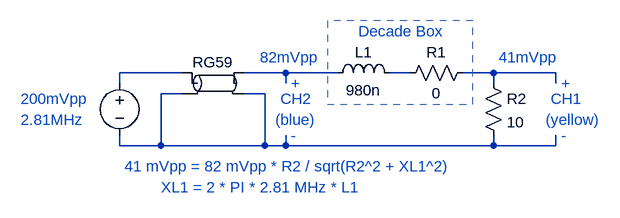
[diagram p0: schematic decade_box_inductance_test.asc]
decade_box_inductance_test.asc, the LTspice schematic file:
Version 4
SHEET 1 932 680
WIRE 272 32 176 32
WIRE 432 32 368 32
WIRE 512 32 432 32
WIRE 624 32 592 32
WIRE 752 32 704 32
WIRE 848 32 752 32
WIRE 176 48 176 32
WIRE 432 48 432 32
WIRE 752 48 752 32
WIRE 848 48 848 32
WIRE 272 64 240 64
WIRE 400 64 368 64
WIRE 176 144 176 128
WIRE 240 144 240 64
WIRE 240 144 176 144
WIRE 400 144 400 64
WIRE 400 144 240 144
WIRE 432 144 432 128
WIRE 432 144 400 144
WIRE 752 144 752 128
WIRE 752 144 432 144
WIRE 848 144 848 128
WIRE 848 144 752 144
SYMBOL voltage 176 32 R0
WINDOW 0 24 16 Invisible 2
SYMATTR InstName V1
SYMATTR Value ""
SYMBOL tline 320 48 R0
SYMATTR InstName RG59
SYMATTR Value ""
SYMBOL ind 496 48 R270
WINDOW 0 32 56 VTop 2
WINDOW 3 5 56 VBottom 2
SYMATTR InstName L1
SYMATTR Value 980n
SYMBOL res 720 16 R90
WINDOW 0 0 56 VBottom 2
WINDOW 3 32 56 VTop 2
SYMATTR InstName R1
SYMATTR Value 0
SYMBOL res 736 32 R0
SYMATTR InstName R2
SYMATTR Value 10
TEXT 24 72 Left 2 ;200mVpp
TEXT 24 104 Left 2 ;2.81MHz
TEXT 440 48 Left 2 ;+
TEXT 440 128 Left 2 ;-
TEXT 424 72 Left 2 ;CH2
TEXT 416 104 Left 2 ;(blue)
TEXT 544 -32 Left 2 ;Decade Box
TEXT 856 48 Left 2 ;+
TEXT 856 128 Left 2 ;-
TEXT 840 72 Left 2 ;CH1
TEXT 832 104 Left 2 ;(yellow)
TEXT 392 8 Left 2 ;82mVpp
TEXT 760 8 Left 2 ;41mVpp
TEXT 184 176 Left 2 ;41 mVpp = 82 mVpp * R2 / sqrt(R2^2 + XL1^2)
TEXT 240 208 Left 2 ;XL1 = 2 * PI * 2.81 MHz * L1
RECTANGLE Normal 720 -48 496 80 2

The netlist it stands for:
* decade_box_inductance_test.asc
V1 N001 N005
T§RG59 N001 N005 N002 N005
L1 N002 N003 980n
R1 N004 N003 0
R2 N004 N005 10
* 200mVpp
* 2.81MHz
* +
* -
* CH2
* (blue)
* Decade Box
* +
* -
* CH1
* (yellow)
* 82mVpp
* 41mVpp
* 41 mVpp = 82 mVpp * R2 / sqrt(R2^2 + XL1^2)
* XL1 = 2 * PI * 2.81 MHz * L1
.backanno
.end